# EAGLE design CAN-MOT-SQIN (EAGLE 9.1.1)
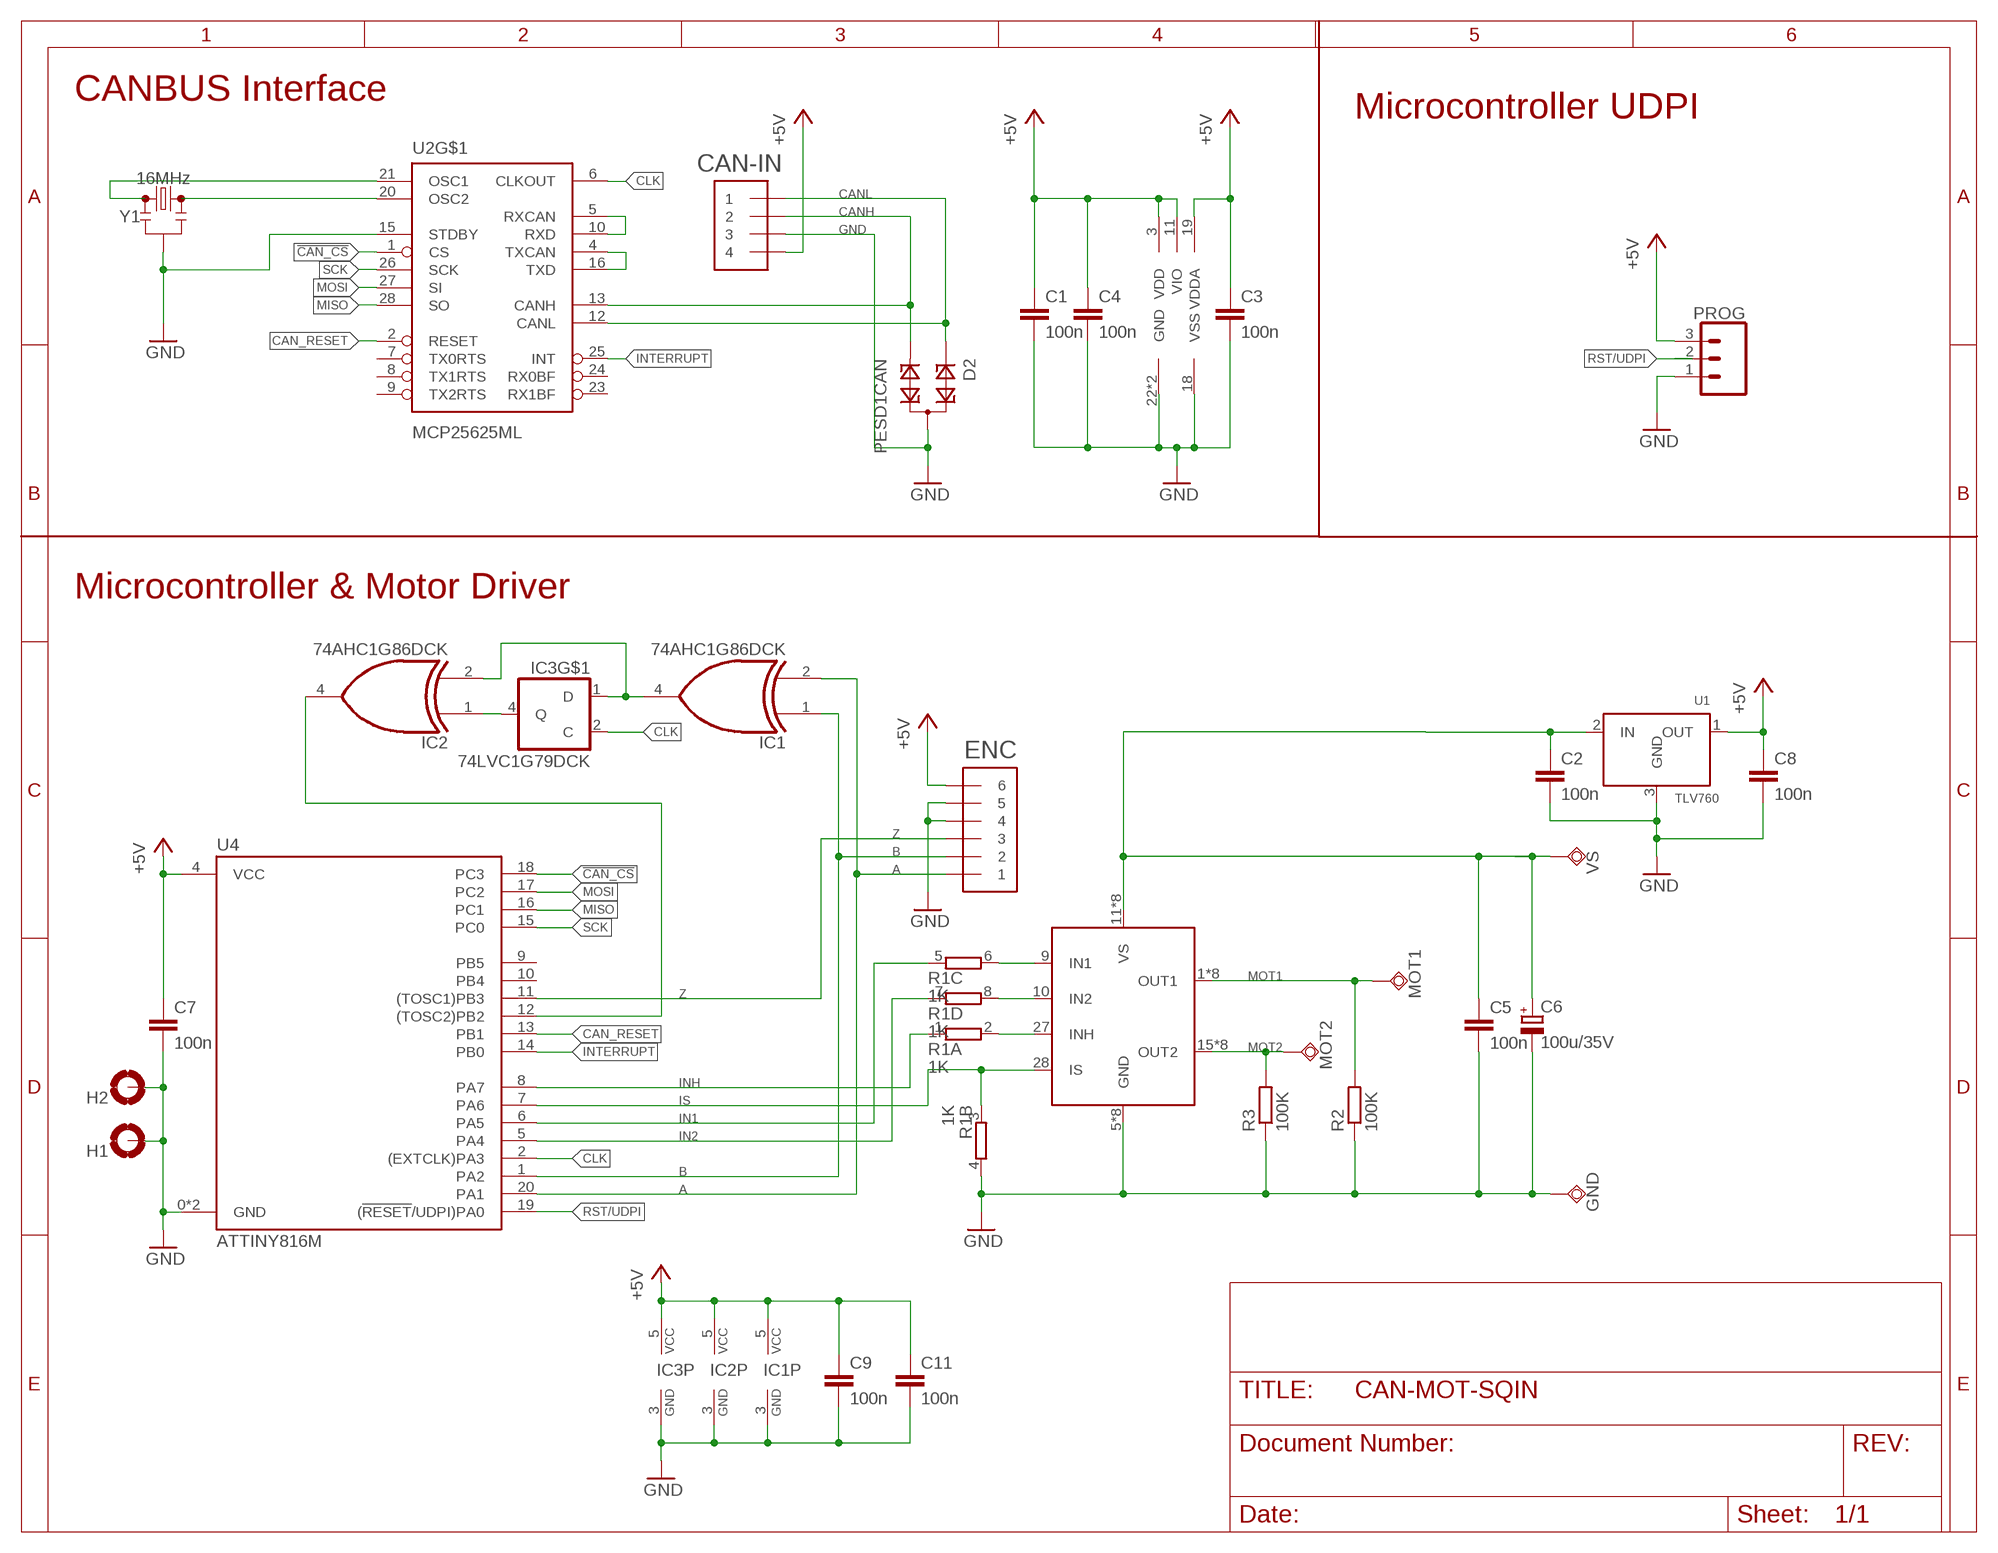
[diagram p0: schematic, sheet 1]

## Parts
C1  100n  C-EUC0603  [C0603]
C2  100n  C-EUC0603  [C0603]
C3  100n  C-EUC0603  [C0603]
C4  100n  C-EUC0603  [C0603]
C5  100n  C-EUC0603  [C0603]
C6  100u/35V  CPOL-EUD  [PANASONIC_D]
C7  100n  C-EUC0603  [C0603]
C8  100n  C-EUC0603  [C0603]
C9  100n  C-EUC0603  [C0603]
C11  100n  C-EUC0603  [C0603]
CAN-IN  STRAWSON_EAGLE_LIB_JST_SH_4  [STRAWSON_EAGLE_LIB_JST_SH_4_SMD]
D2  PESD1CAN  [SOT23]
ENC  STRAWSON_EAGLE_LIB_JST_SH_6  [STRAWSON_EAGLE_LIB_JST_SH_6]
GND  TPSQTP20SQ  [TP20SQ]
H1  MOUNT-PAD-ROUND2.8  [2,8-PAD]
H2  MOUNT-PAD-ROUND2.8  [2,8-PAD]
IC1  74AHC1G86DCK  [SC70-5]
IC2  74AHC1G86DCK  [SC70-5]
IC3  74LVC1G79DCK  [SC70-5]
MOT1  TPSQTP20SQ  [TP20SQ]
MOT2  TPSQTP20SQ  [TP20SQ]
PROG  CONN_03LOCK  [1X03_LOCK]
R1  1K  4R-NCTS742C083  [CTS742C083-RES]
R2  100K  R-EU_R0603  [R0603]
R3  100K  R-EU_R0603  [R0603]
U1  TLV760  [SOT23]
U2  MCP25625ML  [QFN-28(6X6)]
U3  BTM7752G  [PG-DSO-36-29]
U4  ATTINY816M  [QFN20]
VS  TPSQTP20SQ  [TP20SQ]
Y1  16MHz  RESONATOR-16MHZSMD_3.2X1.3  [RESONATOR-SMD-3.2X1.3]

## Nets
!CAN_CS!: U2.1(CS) U4.18(PC3)
+5V: C1.1 C3.1 C4.1 C7.1 C8.1 C9.1 C11.1 CAN-IN.4 ENC.6 IC1.5(VCC) IC2.5(VCC) IC3.5(VCC) PROG.3 U1.1(OUT) U2.3(VDD) U2.11(VIO) U2.19(VDDA) U4.4(VCC)
A: ENC.1 IC1.2(I1) U4.20(PA1)
B: ENC.2 IC1.1(I0) U4.1(PA2)
CAN_RESET: U2.2(RESET) U4.13(PB1)
CANH: CAN-IN.2 D2.2 U2.13(CANH)
CANL: CAN-IN.1 D2.1 U2.12(CANL)
CLK: IC3.2(C) U2.6(CLKOUT) U4.2((EXTCLK)PA3)
GND: C1.2 C2.2 C3.2 C4.2 C5.2 C6.- C7.2 C8.2 C9.2 C11.2 CAN-IN.3 D2.3 ENC.4 ENC.5 GND.TP H1.B2,8(MOUNT) H2.B2,8(MOUNT) IC1.3(GND) IC2.3(GND) IC3.3(GND) PROG.1 R1.4 R2.1 R3.1 U1.3(GND) U2.15(STDBY) U2.18(VSS) U2.22(GND) U2.EP(GND) U3.5(GND) U3.6(GND) U3.7(GND) U3.8(GND) U3.23(GND) U3.24(GND) U3.25(GND) U3.26(GND) U4.0(GND) U4.3(GND) Y1.2
IN1: R1.5 U4.6(PA5)
IN2: R1.7 U4.5(PA4)
INH: R1.1 U4.8(PA7)
INTERRUPT: U2.25(INT) U4.14(PB0)
IS: R1.3 U3.28(IS) U4.7(PA6)
MISO: U2.28(SO) U4.16(PC1)
MOSI: U2.27(SI) U4.17(PC2)
MOT1: MOT1.TP R2.2 U3.1(OUT1) U3.2(OUT1) U3.3(OUT1) U3.4(OUT1) U3.33(OUT1) U3.34(OUT1) U3.35(OUT1) U3.36(OUT1)
MOT2: MOT2.TP R3.2 U3.15(OUT2) U3.16(OUT2) U3.17(OUT2) U3.18(OUT2) U3.19(OUT2) U3.20(OUT2) U3.21(OUT2) U3.22(OUT2)
N$1: U2.4(TXCAN) U2.16(TXD)
N$2: U2.5(RXCAN) U2.10(RXD)
N$3: R1.6 U3.9(IN1)
N$4: IC2.1(I0) IC3.4(Q)
N$5: IC1.4(O) IC2.2(I1) IC3.1(D)
N$6: R1.8 U3.10(IN2)
N$7: R1.2 U3.27(INH)
N$8: IC2.4(O) U4.12((TOSC2)PB2)
N$10: U2.21(OSC1) Y1.1
N$11: U2.20(OSC2) Y1.3
RST/UDPI: PROG.2 U4.19((!RESET!/UDPI)PA0)
SCK: U2.26(SCK) U4.15(PC0)
VS: C2.1 C5.1 C6.+ U1.2(IN) U3.11(VS) U3.12(VS) U3.13(VS) U3.14(VS) U3.29(VS) U3.30(VS) U3.31(VS) U3.32(VS) VS.TP
Z: ENC.3 U4.11((TOSC1)PB3)
Unconnected: U2.7(TX0RTS) U2.8(TX1RTS) U2.9(TX2RTS) U2.23(RX1BF) U2.24(RX0BF) U4.9(PB5) U4.10(PB4)

## Notes on the sheet
- CANBUS Interface
- Microcontroller UDPI
- Microcontroller & Motor Driver

## Library data of the parts
C1-C5 C7-C9 C11 = resistor:C-EU: CAPACITOR, European symbol
C6 = resistor:CPOL-EU: POLARIZED CAPACITOR, European symbol
CAN-IN = can-library:STRAWSON_EAGLE_LIB_JST_SH_4
D2 = diode:PESD1CAN: CAN bus ESD protection diode Source: http://www.nxp.com/documents/data_sheet/PESD1CAN.pdf
ENC = can-library:STRAWSON_EAGLE_LIB_JST_SH_6
GND MOT1 MOT2 VS = testpad:TPSQ: Test pad
H1 H2 = holes:MOUNT-PAD-ROUND: MOUNTING PAD, round
IC1 IC2 = 74xx-little-us:74*1G86: 2-input EXCLUSIV-OR gate
IC3 = 74xx-little-us:74*1G79: Single Positive-Edge-Triggered D-Type Flip-Flop Source: Data sheet <http://www.ti.com/lit/ds/symlink/sn74lvc1g79.pdf>
PROG = SparkFun-Connectors:CONN_03: Multi connection point. Often used as Generic Header-pin footprint for 0.1 inch spaced/style header connections On any of the 0.1 inch spaced packages, you can populate with these: Break Away Headers - Straight <https://www.sparkfun.com/products/116> (PRT-00116) Break Away Male Headers - Right Angle <https://www.sparkfun.com/products/553> (PRT-00553) Female Headers <https://www.sparkfun.com/products/115> (PRT-00115) Break Away Headers - Machine Pin <https://www.sparkfun.com/products/117> (PRT-00117) Break Away Female Headers - Swiss Machine Pin <https://www.sparkfun.com/products/743> (PRT-00743) Stackable Header - 3 Pin (Female, 0.1") <https://www.sparkfun.com/products/13875> (PRT-13875) For SCREWTERMINALS and SPRING TERMINALS visit here: Screw Terimnals on SparkFun.com <https://www.sparkfun.com/search/results?term=Screw+Terminals> (5mm/3.5mm/2.54mm spacing) This device is also useful as a general connection point to wire up your design to another part of your project. Our various solder wires solder well into these plated through hole pads. Hook-Up Wire - Assortment (Stranded, 22 AWG) <https://www.sparkfun.com/products/11375> (PRT-11375) Hook-Up Wire - Assortment (Solid Core, 22 AWG) <https://www.sparkfun.com/products/11367> (PRT-11367) View the entire wire category on our website here <https://www.sparkfun.com/categories/141> Special notes: Molex polarized connector foot print use with SKU : PRT-08232 with associated crimp pins and housings.
R1 = res-cap-arrays:4R-N: Array Chip Resistor Source: RS Component / Phycomp
R2 R3 = resistor:R-EU_: RESISTOR, European symbol
U1 = can-library:TLV760
U2 = can-library:MCP25625
U3 = can-library:BTM7752G
U4 = can-library:ATTINY816
Y1 = SparkFun-Clocks:RESONATOR-16MHZ: 16MHz Resonator Digikey Example <http://www.digikey.com/product-detail/en/murata-electronics-north-america/CSTCE16M0V53-R0/490-1198-1-ND/584635> Frequency: 16MHz Frequency Stability: ±0.3% Frequency Tolerance: ±0.5% Capacitance: 15pF SparkFun Products SparkFun OpenLog <https://www.sparkfun.com/products/13712> SparkFun MicroView - OLED Arduino Module <https://www.sparkfun.com/products/12923>; PARTNO: PRQC16.00CR5010X000; PROD_ID: XTAL-08900

## Board
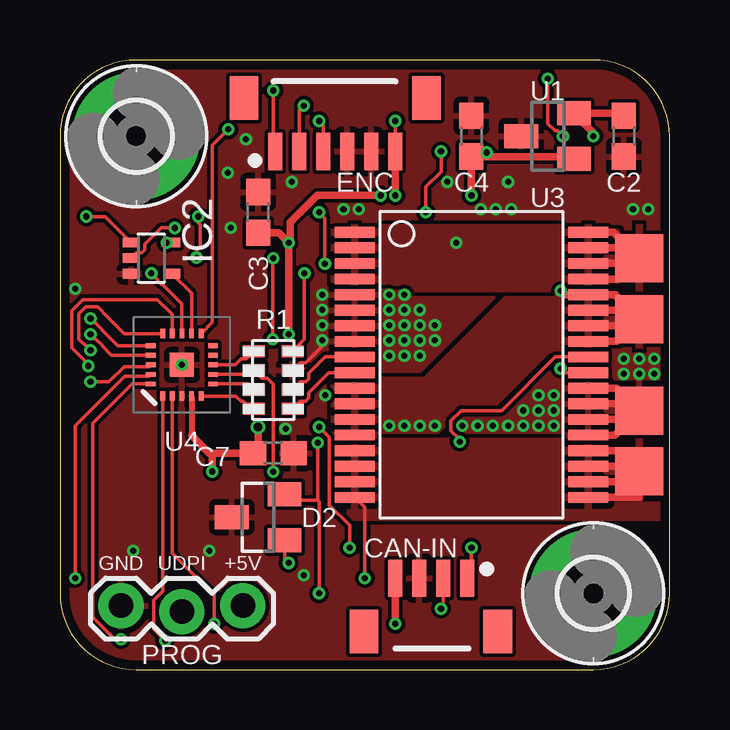
[diagram p1: board, top side]
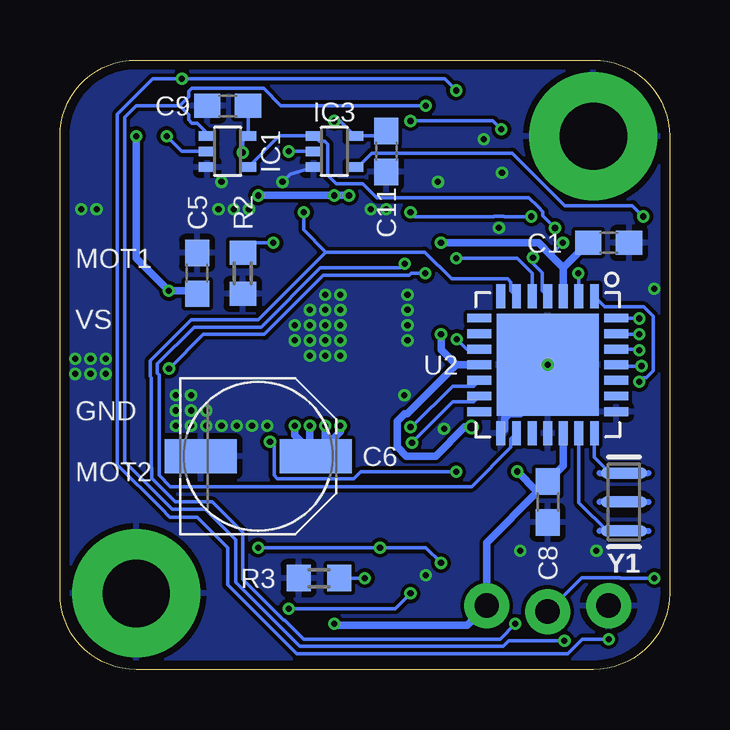
[diagram p2: board, bottom side, seen from below]

Size 25.4 x 25.4 mm. Coordinates in mm from the lower left corner, seen from the top.
Outline: 0,22.23 0,3.17 arc90 3.17,0 22.23,0 arc90 25.4,3.17 25.4,22.23 arc90 22.23,25.4 3.17,25.4 arc90 0,22.23
Copper layers (1*16): Top 0.035559375mm / dielectric 1.6mm / Bottom 0.035559375mm
Design rules "oshpark-2layer *": minimum track width 6mil, minimum drill 10mil, track to track 6mil, track to pad 6mil, pad to pad 6mil, via to via 6mil, smd to smd 6mil, copper to edge 15mil, drill to drill 6mil, minimum pad ring 5mil, minimum via ring 5mil, stop-mask expansion 2.5mil, vias tented up to drill 25mil, thermal gap 10mil

### Footprints (pad centres in the part's own frame; a part is rotated, then mirrored left to right if it is on the bottom)
C0603 = smd 1.1 x 1: 1 -0.85,0; 2 0.85,0
PANASONIC_D = smd 3 x 1.4: + 2.4,0; - -2.4,0
STRAWSON_EAGLE_LIB_JST_SH_4_SMD = smd 0.6 x 1.55: 1 0.46,1.27; 2 -0.54,1.27; 3 -1.54,1.27; 4 -2.54,1.27 | smd 1.2 x 1.8: P$1 -3.84,-0.955; P$2 1.728,-0.955
SOT23 = smd 1 x 1.4: 1 -0.95,-1.1; 2 0.95,-1.1; 3 0,1.1
STRAWSON_EAGLE_LIB_JST_SH_6 = smd 0.6 x 1.55: 1 5,0; 2 4,0; 3 3,0; 4 2,0; 5 1,0; 6 0,0 | smd 1.2 x 1.8: P$1 -1.3,-2.225; P$2 6.3,-2.225
TP20SQ = smd 2 x 2: TP 0,0
2,8-PAD = drill 2.8 pad 5.334: B2,8 0,0
SC70-5 = smd 0.4 x 0.7: 1 -0.65,-0.85; 2 0,-0.85; 3 0.65,-0.85; 4 0.65,0.85; 5 -0.65,0.85
1X03_LOCK = drill 1.016 pad 1.88: 1 0,0.127; 2 2.54,-0.127; 3 5.08,0.127
CTS742C083-RES = smd 0.9 x 0.5: 1 -0.8,1.2; 2 0.8,1.2; 3 -0.8,0.4; 4 0.8,0.4; 5 -0.8,-0.4; 6 0.8,-0.4; 7 -0.8,-1.2; 8 0.8,-1.2
R0603 = smd 1 x 1.1: 1 -0.85,0; 2 0.85,0
QFN-28(6X6) = smd 1 x 0.37: 1 -2.85,1.95; 2 -2.85,1.3; 3 -2.85,0.65; 4 -2.85,0; 5 -2.85,-0.65; 6 -2.85,-1.3; 7 -2.85,-1.95; 15 2.85,-1.95; 16 2.85,-1.3; 17 2.85,-0.65; 18 2.85,0; 19 2.85,0.65; 20 2.85,1.3; 21 2.85,1.95 | smd 0.37 x 1: 8 -1.95,-2.85; 9 -1.3,-2.85; 10 -0.65,-2.85; 11 0,-2.85; 12 0.65,-2.85; 13 1.3,-2.85; 14 1.95,-2.85; 22 1.95,2.85; 23 1.3,2.85; 24 0.65,2.85; 25 0,2.85; 26 -0.65,2.85; 27 -1.3,2.85; 28 -1.95,2.85 | smd 4.25 x 4.25: EP 0,0
PG-DSO-36-29 = smd 1.67 x 0.45: 1 -4.865,5.525; 2 -4.865,4.875; 3 -4.865,4.225; 4 -4.865,3.575; 5 -4.865,2.925; 6 -4.865,2.275; 7 -4.865,1.625; 8 -4.865,0.975; 9 -4.865,0.325; 10 -4.865,-0.325; 11 -4.865,-0.975; 12 -4.865,-1.625; 13 -4.865,-2.275; 14 -4.865,-2.925; 15 -4.865,-3.575; 16 -4.865,-4.225; 17 -4.865,-4.875; 18 -4.865,-5.525; 19 4.865,-5.525; 20 4.865,-4.875; 21 4.865,-4.225; 22 4.865,-3.575; 23 4.865,-2.925; 24 4.865,-2.275; 25 4.865,-1.625; 26 4.865,-0.975; 27 4.865,-0.325; 28 4.865,0.325; 29 4.865,0.975; 30 4.865,1.625; 31 4.865,2.275; 32 4.865,2.925; 33 4.865,3.575; 34 4.865,4.225; 35 4.865,4.875; 36 4.865,5.525
QFN20 = smd 1 x 1: 0 0,0 | smd 0.4 x 0.2: 1 -1.3,0.8; 2 -1.3,0.4; 3 -1.3,0; 4 -1.3,-0.4; 5 -1.3,-0.8; 11 1.3,-0.8; 12 1.3,-0.4; 13 1.3,0; 14 1.3,0.4; 15 1.3,0.8 | smd 0.2 x 0.4: 6 -0.8,-1.3; 7 -0.4,-1.3; 8 0,-1.3; 9 0.4,-1.3; 10 0.8,-1.3; 16 0.8,1.3; 17 0.4,1.3; 18 0,1.3; 19 -0.4,1.3; 20 -0.8,1.3
RESONATOR-SMD-3.2X1.3 = smd 0.45 x 1.905: 1 -1.2,0; 2 0,0; 3 1.2,0

### Placement (x,y rotation side)
C1  2.54,17.78 0 bottom
C2  23.5,22.23 270 top
C3  8.26,19.05 90 top
C4  17.14,22.23 90 top
C5  19.68,16.51 90 bottom
C6  17.14,8.89 0 bottom
C7  8.89,9.02 0 top
C8  5.08,6.99 270 bottom
C9  18.41,23.5 180 bottom
C11  11.81,21.59 270 bottom
CAN-IN  16.51,2.54 0 top
D2  8.26,6.35 90 top
ENC  13.97,21.59 180 top
GND  24.13,10.79 0 top
H1  22.23,3.17 0 top
H2  3.17,22.23 0 top
IC1  18.41,21.59 270 bottom
IC2  3.81,17.14 270 top
IC3  13.97,21.59 270 bottom
MOT1  24.13,17.14 0 top
MOT2  24.13,8.26 0 top
PROG  2.54,2.54 0 top
R1  8.89,12.06 0 top
R2  17.78,16.51 90 bottom
R3  14.61,3.81 0 bottom
U1  20.32,22.23 90 top
U2  5.08,12.7 270 bottom
U3  17.14,12.7 0 top
U4  5.08,12.7 90 top
VS  24.13,14.61 0 top
Y1  1.91,6.99 270 bottom

### Tracks (layer width: path | path; a pad name or v marks a point on that pad's centre or on a via)
!CAN_CS!  (via drill 0.25)
  Top 0.152: U4.18 3.71,12.63 2.67,12.63 2.03,11.99 v1.27,11.99
  Bottom 0.152: v1.27,11.99 1.09,12.17 0.97,12.17 0.69,12.45 0.69,14.73 1.07,15.11 2.69,15.11 U2.1
+5V  (via drill 0.25, 0.35)
  Top 0.152: v13.97,22.86 ENC.6 | 18.41,21.32 18.41,21.38 | IC2.5 4.79,17.78 v4.45,17.78 | v17.78,21.55 17.78,21.38
  Top 0.254: U4.4 5.48,9.76
  Top 0.305: v9.53,13.97 v9.53,17.78 | U1.1 21.32,21.38 18.41,21.38 17.78,21.38 C4.1 v17.14,19.75 | v9.53,17.78 9.11,18.2 C3.1 | v13.36,19.75 10.71,19.75 9.6,18.65 9.6,17.86 v9.53,17.78 | ENC.6 v13.97,19.75 | v13.97,1.91 CAN-IN.4 | 6.35,9.02 6.22,9.02 5.71,9.53 5.48,9.76 | 6.35,9.02 C7.1 8.26,9.23 v8.26,10.11 | 6.35,9.02 v6.35,8.26
  Bottom 0.152: 13.74,22.86 v13.97,22.86 13.74,22.86 | C9.1 IC1.5 17.78,22.02 v17.78,21.55 | C11.1 12.01,22.24 IC3.5 13.74,22.86 | 4.95,17.27 v4.45,17.78
  Bottom 0.254: 4.43,16.75 U2.3
  Bottom 0.305: 4.43,16.75 4.95,17.27 5.46,17.78 6.99,17.78 v9.53,17.78 | U2.11 8.89,12.7 | 8.89,12.7 9.53,13.34 v9.53,13.97 | U2.3 4.43,16.74 C1.1 | v13.36,19.75 v13.97,19.75 v17.14,19.75 | v13.97,1.91 13.92,1.86 8.43,1.86 PROG.3 7.62,5.29 5.5,7.41 | 5.5,7.41 C8.1 4.43,8.48 U2.19 | v6.35,8.26 5.5,7.41 | v8.26,10.11 8.53,10.11 9.75,8.89 10.96,8.89 11.35,9.28 11.35,10.34 11.03,10.67 10.92,10.67 8.89,12.7
A  (via drill 0.25)
  Top 0.152: v8.89,24.13 8.89,21.67 ENC.1 | v2.54,1.27 2.29,1.27 1.37,2.18 1.37,10.26 3.01,11.9 U4.20 | v20.31,24.61 v20.32,24.61 20.32,22.75 20.62,22.45 20.73,22.45 v20.95,22.23
  Bottom 0.152: v2.54,1.27 3.64,1.27 4.25,0.66 15.54,0.66 18.41,3.54 18.41,4.45 18.41,5.08 19.68,6.35 20.82,6.35 21.21,6.73 23.01,8.54 23.01,23.14 21.54,24.61 v20.32,24.61 9.37,24.61 v8.89,24.13 | v20.95,22.23 20.32,21.59 IC1.2
B  (via drill 0.25)
  Top 0.152: v4.38,1.21 3.91,1.68 3.91,2.9 4.28,3.27 U4.1 | v10.16,23.5 9.97,23.3 ENC.2
  Bottom 0.152: v4.38,1.21 6.69,1.21 6.93,0.96 15.41,0.96 18.09,3.64 18.09,5.41 19.36,6.68 20.72,6.68 22.71,8.67 22.71,23.01 22.23,23.5 20.41,23.5 | v10.16,23.5 16.19,23.5 16.92,24.22 19.91,24.22 20.04,24.09 20.04,23.86 20.41,23.5 | IC1.1 19.27,22.35 19.68,22.77 19.91,22.77 20.04,22.9 20.04,23.12 20.41,23.5
CAN_RESET  (via drill 0.25)
  Top 0.152: U4.13 5.08,15.24 4.25,16.07 4.21,16.07 4.08,16.2 4.08,16.24 v3.81,16.51
  Bottom 0.152: U2.2 3.78,16.48 v3.81,16.51
CANH  (via drill 0.25)
  Top 0.152: v10.79,3.17 10.79,6.99 10.73,7.05 | v10.73,9.45 10.73,7.05 | D2.2 9.61,7.05 10.73,7.05 | v15.88,2.54 15.97,2.63 CAN-IN.2
  Bottom 0.152: v10.79,3.17 11.43,2.54 v15.88,2.54 | U2.13 8.17,11.16 9.03,11.16 10.73,9.46 v10.73,9.45
CANL  (via drill 0.25)
  Top 0.152: 17.14,3.98 CAN-IN.1 17.14,3.98 | v9.53,4.45 9.36,4.62 D2.1 | v10.79,10.11 11.22,9.69 11.22,6.86 12.06,6.01 v12.06,5.08 | 17.14,3.98 v17.14,5.08
  Bottom 0.152: v9.53,4.45 10.16,5.08 v12.06,5.08 v17.14,5.08 | U2.12 8.17,11.81 9.03,11.81 10.74,10.11 v10.79,10.11
CLK  (via drill 0.25)
  Top 0.152: v6.43,1.91 6.43,3.1 4.68,4.84 U4.2 | v15.24,19.05 15.24,20.11 15.88,20.75 v15.88,21.59
  Bottom 0.152: v6.43,1.91 7.06,1.27 15.24,1.27 16.03,2.06 16.07,2.06 17.78,3.76 17.78,5.71 19.05,6.99 20.59,6.99 21.58,7.97 21.58,8.4 21.59,8.41 21.59,12.16 21.64,12.22 21.64,12.87 19.93,14.58 17.14,14.58 14.32,17.4 | U2.6 6.62,15.79 6.62,16.14 6.75,16.28 9.08,16.28 10.2,17.4 14.32,17.4 | v15.24,19.05 15.24,18.32 14.32,17.4 | IC3.2 v15.88,21.59
GND  (via drill 0.25)
  Top 0.152: R1.4 10.01,12.79 10.23,12.79 10.92,13.47 v10.92,13.72
  Top 0.305: U3.26 23.2,11.72 GND.TP | U3.25 23.85,11.07 GND.TP | U3.24 23.76,10.43 23.81,10.48 | 23.81,10.48 GND.TP | U3.23 23.11,9.78 23.81,10.48
  Bottom 0.152: IC3.3 15.81,20.64 v16.13,20.32
  Bottom 0.305: U2.EP 5.08,11.8 6.22,10.65 6.69,10.65 6.87,10.48 6.87,10.01 U2.15
  other vias: 13.72,15.62 13.72,14.99 13.72,14.35 13.72,13.72 14.35,13.72 14.35,14.35 14.35,14.99 14.35,15.62 10.92,15.62 10.92,14.99 10.92,14.35 10.16,3.94 20.57,10.16 19.94,10.16 19.3,10.16 18.67,10.16 18.03,10.16 17.4,10.16 16.76,10.16 11.81,19.18 12.45,19.18 5.08,12.7 24.77,12.32 24.13,12.32 23.5,12.32 23.5,12.95 24.13,12.95 24.77,12.95 9.4,10.03 11.05,11.43 6.22,4.95 20.57,10.79 20.57,11.43 19.94,10.79 19.94,11.43 19.3,10.79 13.72,13.08 14.35,13.08 14.99,13.08 14.99,13.72 14.99,14.35 14.99,14.99 15.62,14.35 15.62,13.72 3.05,4.95 0.64,15.88 18.67,20.32 6.99,20.7 9.65,20.32 7.11,18.41 7.75,22.1 17.53,19.18 18.16,19.18 18.8,19.18 23.88,19.18 24.51,19.18
  pour Top (rank 3): -1.27,-1.27 26.67,-1.27 26.67,26.67 -1.27,26.67
  pour Bottom (rank 2): -0.64,-0.64 -0.64,26.04 26.04,26.04 26.04,-0.64
IN1
  Top 0.152: U4.6 7.86,11.9 R1.5
IN2
  Top 0.152: R1.7 8.03,10.8 7.64,11.19 7.54,11.19 7.33,11.4 U4.5
INH
  Top 0.152: R1.1 7.77,12.94 7.54,12.94 7.3,12.7 U4.8
INTERRUPT  (via drill 0.25)
  Top 0.152: v1.17,12.65 1.17,12.72 0.48,13.41 0.48,14.96 0.94,15.42 4.06,15.42 4.68,14.8 U4.14
  Bottom 0.152: U2.25 2.18,12.65 v1.17,12.65
IS  (via drill 0.25)
  Top 0.152: v8.89,8.24 8.89,11.89 8.63,12.14 8.41,12.14 R1.3 7.92,12.3 U4.7 | v16.65,9.5 16.65,9.59 16.28,9.96 16.28,10.36 16.72,10.79 18.41,10.79 20.64,13.03 U3.28
  Bottom 0.152: v16.65,9.5 16.47,9.32 16.47,8.1 16.34,7.96 13.15,7.96 12.87,8.24 v8.89,8.24
MISO  (via drill 0.25)
  Top 0.152: U4.16 2.4,13.5 1.75,14.15 1.75,14.17 1.47,14.45 1.45,14.45 v1.27,14.63
  Bottom 0.152: v1.27,14.63 2.21,14.63 U2.28
MOSI  (via drill 0.25)
  Top 0.152: v1.27,13.97 1.45,13.79 1.47,13.79 1.75,13.51 1.75,13.49 2.14,13.1 U4.17
  Bottom 0.152: v1.27,13.97 2.2,13.97 U2.27
MOT1  (via drill 0.25)
  Top 0.305: U3.36 23.05,18.23 MOT1.TP | U3.35 23.7,17.57 MOT1.TP | MOT1.TP 23.91,16.93 U3.34 | MOT1.TP 23.26,16.27 U3.33
  Bottom 0.152: R2.2 17.36,17.78 v16.51,17.78
  pour Top: 11.43,15.88 25.4,15.88 25.4,18.41 11.43,18.41
MOT2  (via drill 0.25)
  Top 0.152: U3.18 12.7,6.75 v12.7,3.81
  Top 0.305: MOT2.TP 24.13,9.12 U3.22 | MOT2.TP 24.13,8.47 U3.21 | U3.20 24.13,7.83 | 24.13,7.83 MOT2.TP | U3.19 24.13,7.17 24.13,7.83
  Bottom 0.152: v12.7,3.81 R3.2
  pour Top: 11.43,6.35 25.4,6.35 25.4,9.53 11.43,9.53
N$1  (via drill 0.25)
  Top 0.152: v11.04,16.92 11.04,18.81 v10.79,19.05 | v5.76,18.88 5.69,18.81 5.69,18.68 5.83,18.54 5.83,17.66 5.69,17.51 v5.69,17.17
  Bottom 0.152: 21.34,12.34 21.34,12.74 | U2.16 6.62,9.61 6.62,9.26 8.25,7.62 20.8,7.62 21.27,8.1 21.27,12.28 21.34,12.34 | 21.34,12.74 19.81,14.28 17.02,14.28 14.55,16.74 11.22,16.74 v11.04,16.92 | 21.34,12.74 21.34,12.34 | U2.4 5.32,15.79 5.32,16.54 5.69,16.92 v5.69,17.17 | v10.79,19.05 10.62,18.88 7.33,18.88 7.31,18.9 6.91,18.9 6.89,18.88 v5.76,18.88
N$2  (via drill 0.25)
  Top 0.152: v8.89,17.14 8.87,17.12 v8.87,13.77
  Bottom 0.152: U2.5 5.73,16.52 6.35,17.14 v8.89,17.14 | v8.87,13.77 8.45,13.35 U2.10
N$3
  Top 0.152: U3.9 11.05,13.03 10.37,12.34 10.37,12.12 10.23,11.99 10.01,11.99 R1.6
N$4  (via drill 0.25)
  Top 0.152: v1.1,18.88 1.88,18.88 IC2.1
  Bottom 0.152: v1.1,18.88 1.55,19.33 4.37,19.33 6.56,21.52 12.41,21.52 12.98,20.94 IC3.4
N$5  (via drill 0.25)
  Top 0.152: v4.78,18.4 4.22,18.4 3.54,17.72 3.54,17.5 3.4,17.37 3.18,17.37 IC2.2
  Bottom 0.152: IC1.4 16.27,22.24 IC3.1 14.6,22.02 14.38,22.02 14.24,21.89 14.24,20.59 13.89,20.24 12.78,20.24 12.2,19.66 5.86,19.66 5.48,19.28 5.28,19.08 5.28,18.9 v4.78,18.4
N$6
  Top 0.152: U3.10 11.2,12.38 10.37,11.54 10.37,11.32 10.23,11.19 10.01,11.19 R1.8
N$7  (via drill 0.25)
  Top 0.152: U3.27 21.02,12.38 v20.86,12.54 | v10.19,16.51 10.19,13.76 R1.2
  Bottom 0.152: v20.86,12.54 19.43,13.97 16.89,13.97 14.43,16.43 10.84,16.43 10.76,16.51 v10.19,16.51
N$8
  Top 0.152: U4.12 5.48,15.68 IC2.4
N$10
  Bottom 0.152: U2.21 3.13,8.85 2.47,8.19 Y1.1
N$11
  Bottom 0.152: U2.20 3.78,6.96 2.54,5.71 2.47,5.79 Y1.3
RST/UDPI  (via drill 0.25)
  Top 0.152: v0.64,3.81 0.64,10.16 2.7,12.23 3.71,12.23 U4.19
  Bottom 0.152: v0.64,3.81 2.03,3.81 2.06,3.83 3.66,3.83 PROG.2
SCK  (via drill 0.25)
  Top 0.152: v1.27,13.31 1.09,13.49 1.07,13.49 0.79,13.77 0.79,14.83 1.07,15.11 1.56,15.11 1.99,14.69 2.68,14 U4.15
  Bottom 0.152: U2.26 1.31,13.35 v1.27,13.31
VS  (via drill 0.25)
  Top 0.305: C2.1 23.39,23.18 U1.2 22.23,22.37 v22.23,22.23 | VS.TP 23.11,15.62 U3.32 21.02,15.62 v20.86,15.79 | VS.TP 23.76,14.97 U3.31 | U3.30 23.85,14.32 VS.TP | VS.TP 23.2,13.68 U3.29
  Bottom 0.305: v22.23,22.23 22.23,17.14 20.95,15.88 v20.86,15.79 19.81,15.79 C5.1 | v14.99,10.16 14.99,9.13 C6.+ | v15.62,10.16 15.62,9.77 C6.+ | v14.35,10.16 14.35,9.28 C6.+ | v13.72,10.16 13.72,9.92 C6.+
  pour Top (rank 2): 11.43,9.53 15.24,9.53 16.51,10.79 17.78,10.79 20.32,13.34 25.4,13.34 25.4,15.88 19.05,15.88 15.24,12.06 11.43,12.06
Z  (via drill 0.25)
  Top 0.152: v10.79,22.86 10.97,22.68 ENC.3 | v7.01,22.51 6.35,21.85 6.35,14.47 U4.11
  Bottom 0.152: v10.79,22.86 7.36,22.86 v7.01,22.51

### Text on the board
tPlace: GND | UDPI | +5V